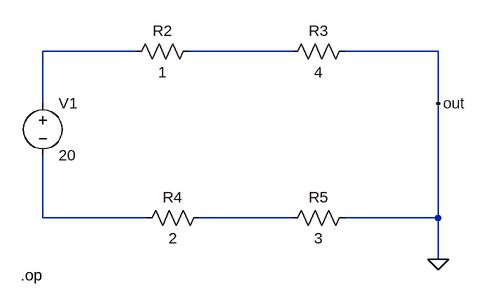
[diagram p0: schematic Draft1.asc]
Draft1.asc, the LTspice schematic file:
Version 4
SHEET 1 880 680
WIRE 48 48 -96 48
WIRE 288 48 128 48
WIRE 512 48 368 48
WIRE -96 128 -96 48
WIRE 512 128 512 48
WIRE -96 304 -96 208
WIRE 64 304 -96 304
WIRE 288 304 144 304
WIRE 512 304 512 128
WIRE 512 304 368 304
WIRE 512 368 512 304
FLAG 512 368 0
FLAG 512 128 out
SYMBOL voltage -96 112 R0
WINDOW 123 0 0 Left 2
WINDOW 39 0 0 Left 2
SYMATTR InstName V1
SYMATTR Value 20
SYMBOL res 144 32 R90
WINDOW 0 0 56 VBottom 2
WINDOW 3 32 56 VTop 2
SYMATTR InstName R2
SYMATTR Value 1
SYMATTR SpiceLine tol=1 pwr=0.1
SYMBOL res 384 32 R90
WINDOW 0 0 56 VBottom 2
WINDOW 3 32 56 VTop 2
SYMATTR InstName R3
SYMATTR Value 4
SYMBOL res 48 320 R270
WINDOW 0 32 56 VTop 2
WINDOW 3 0 56 VBottom 2
SYMATTR InstName R4
SYMATTR Value 2
SYMBOL res 272 320 R270
WINDOW 0 32 56 VTop 2
WINDOW 3 0 56 VBottom 2
SYMATTR InstName R5
SYMATTR Value 3
TEXT -130 392 Left 2 !.op

The netlist it stands for:
* Draft1.asc
V1 N001 N003 20
R2 N002 N001 1 tol=1 pwr=0.1
R3 0 N002 4
R4 N003 N004 2
R5 N004 0 3
.op
.backanno
.end